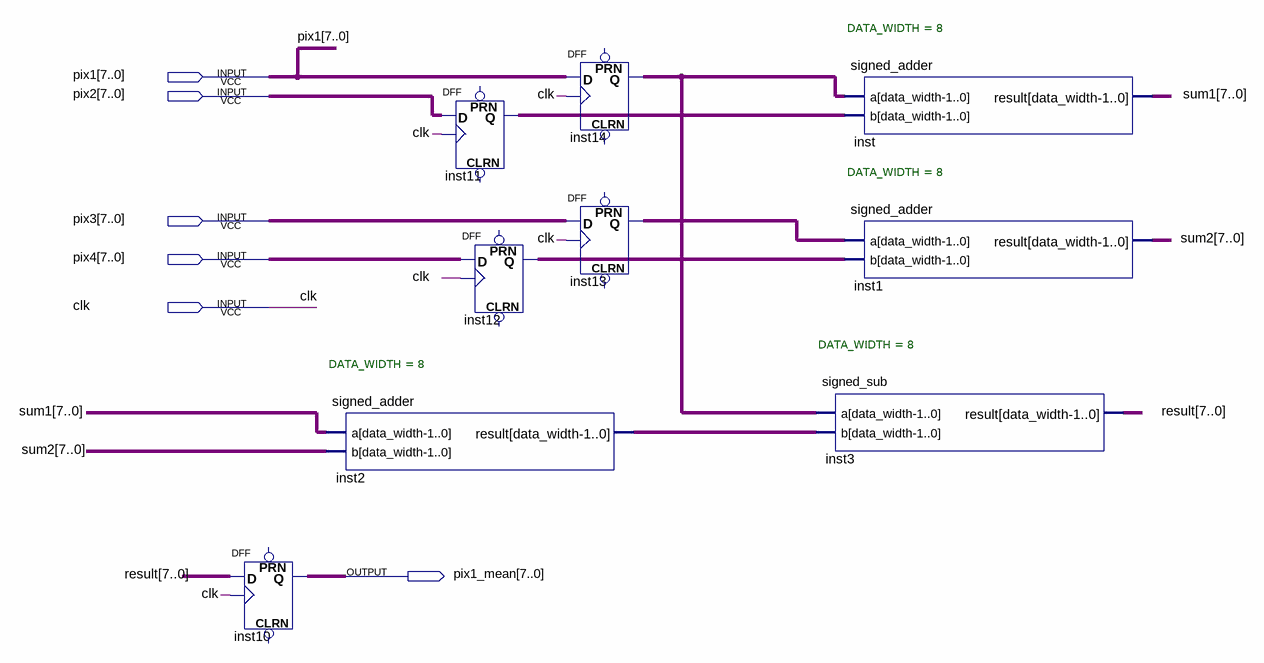
[diagram p0: schematic sheet]
// Quartus schematic simple_2.bdf as structural Verilog: 9 symbols, 6 pins
module simple_2 (
  input  [7:0] pix1,
  input  [7:0] pix2,
  input  [7:0] pix3,
  input  [7:0] pix4,
  input  clk,
  output [7:0] pix1_mean
);

  wire [7:0] inst2_result, inst11_q, inst12_q, inst13_q, inst14_q, result, sum1, sum2;

  DFF inst10[7:0] (.CLK(clk), .D(result), .Q(pix1_mean));  // open: CLRN, PRN
  signed_adder #(.DATA_WIDTH(8)) inst2 (.a(sum1), .b(sum2), .result(inst2_result));
  DFF inst11[7:0] (.CLK(clk), .D(pix2), .Q(inst11_q));  // open: CLRN, PRN
  DFF inst12[7:0] (.CLK(clk), .D(pix4), .Q(inst12_q));  // open: CLRN, PRN
  DFF inst14[7:0] (.CLK(clk), .D(pix1), .Q(inst14_q));  // open: CLRN, PRN
  DFF inst13[7:0] (.CLK(clk), .D(pix3), .Q(inst13_q));  // open: CLRN, PRN
  signed_adder #(.DATA_WIDTH(8)) inst (.a(inst14_q), .b(inst11_q), .result(sum1));
  signed_adder #(.DATA_WIDTH(8)) inst1 (.a(inst13_q), .b(inst12_q), .result(sum2));
  signed_sub #(.DATA_WIDTH(8)) inst3 (.a(inst14_q), .b(inst2_result), .result(result));
endmodule
